# EasyEDA schematic SCH_Inky CO2 Sensor.json
TITLE: Sheet_1; REV: 1.0; Date: 2022-11-12; Sheet: 1/1; Drawn By: fmefi; Company: Your Company
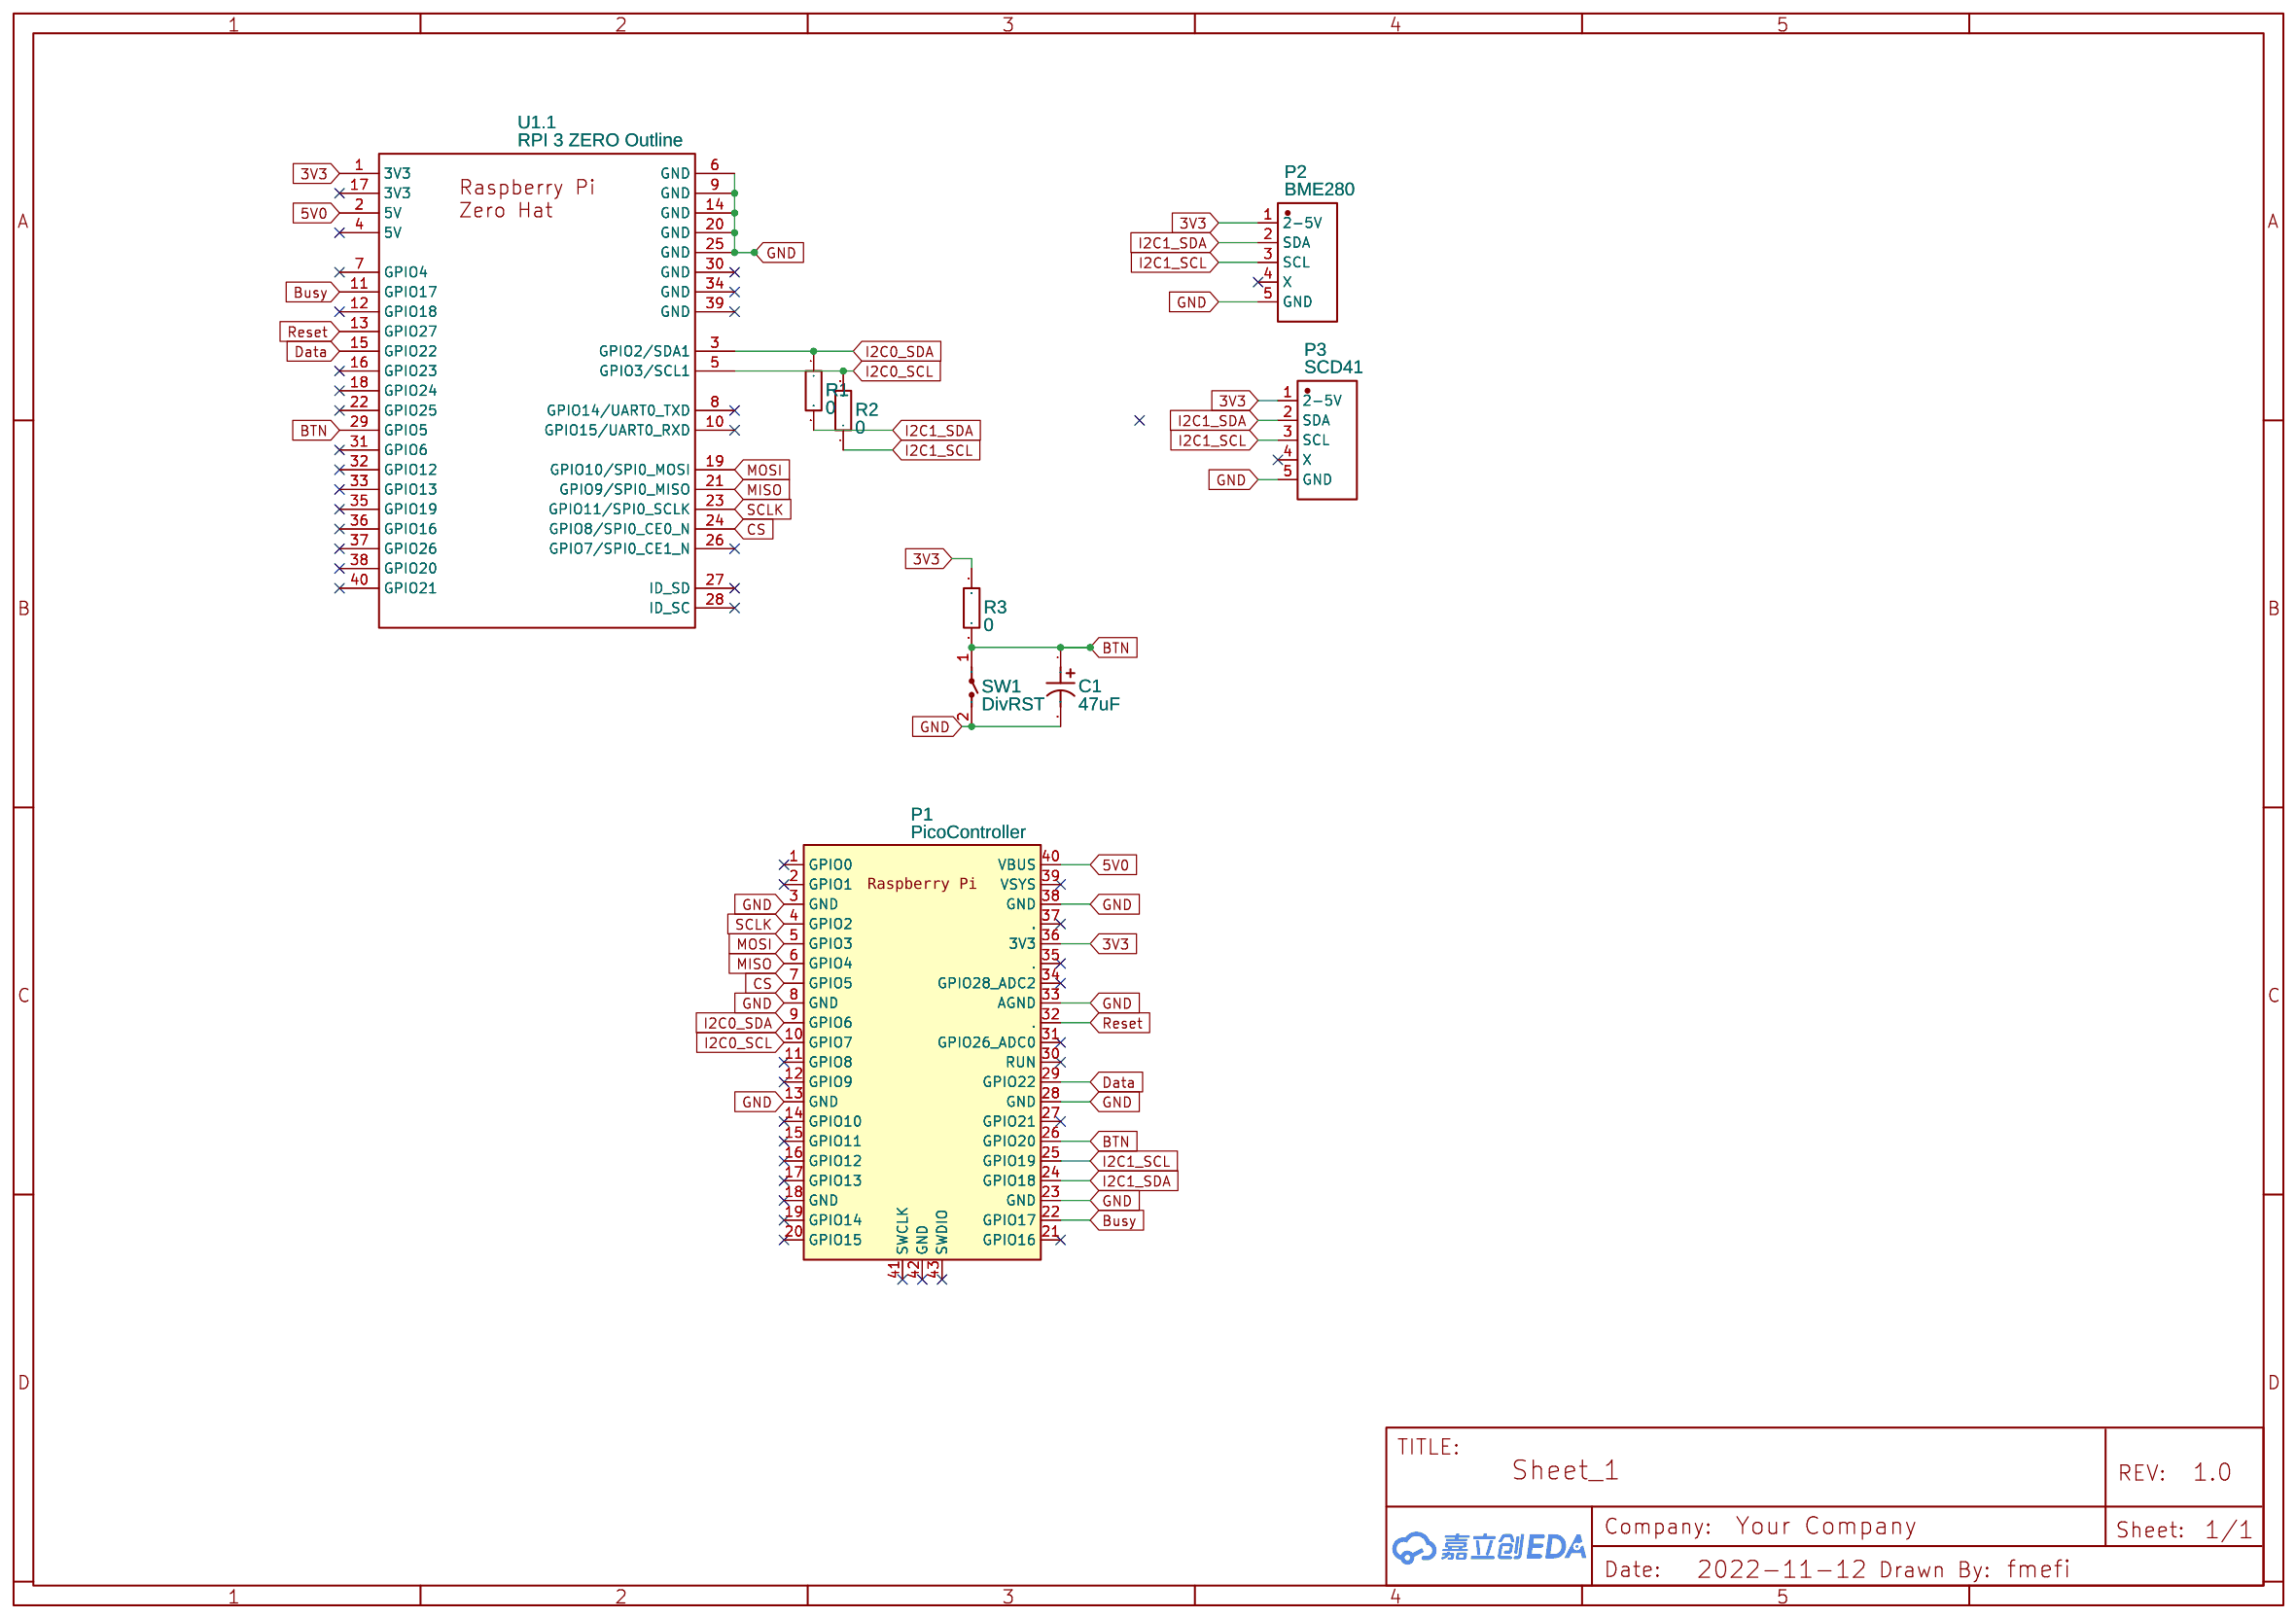
[diagram p0: schematic sheet]

## Parts
C1  47uF  [CAP-SMD_BD6.3-L6.6-W6.6-LS7.2-FD]
P1  PicoController  [RPI_PICO_SMD_TH]
P2  BME280  [BME680_PIMORONI]
P3  SCD41  [BME680_PIMORONI]
R1  0  [R0805]
R2  0  [R0805]
R3  0  [R0805]
SW1  DivRST  [SW-SMD_L6.0-W3.5-LS8.0-EH]
U1  RPI 3 ZERO Outline  [RPI3_ZERO]  (section 1)

## Library data of the parts
C1 = RVT47UF35V67RV0039: Supplier: LCSC; Supplier Part: C2836440; Manufacturer: KNSCHA(科尼盛); JLCPCB Part Class: Extended Part; Contributor: LCSC
P1 = Pico: Contributor: Alexey Gumenchuk
P2 P3 = BME680_PIMORONI: Supplier Part: C50951; Manufacturer: ReliaPro; Manufacturer Part: 2.54mm 1*5P Header; Contributor: timoschrevel
R1-R3 = 0805W8F0000T5E: Supplier: LCSC; Manufacturer: UniOhm; Supplier Part: C17477; JLCPCB Part Class: Basic Part
SW1 = TS-1001T-AC04316: Supplier: LCSC; Supplier Part: C720484; Manufacturer: XUNPU; Contributor: LCSC; JLCPCB Part Class: Extended Part
U1 = RPI 3 ZERO Outline: Manufacturer: Raspberry Pi Foundation; Supplier Part: undefined; Supplier: Adafruit; Contributor: LucAce; subpart_no: 1

## Nets
3V3: P1.36(3V3) P2.1(2-5V) P3.1(2-5V) R3.1 U1.1(3V3)
5V0: P1.40(VBUS) U1.2(5V)
GND: C1.2 P1.3(GND) P1.8(GND) P1.13(GND) P1.23(GND) P1.28(GND) P1.33(AGND) P1.38(GND) P2.5(GND) P3.5(GND) SW1.2 U1.6(GND) U1.9(GND) U1.14(GND) U1.20(GND) U1.25(GND)
BTN: C1.1 P1.26(GPIO20) R3.2 SW1.1 U1.29(GPIO5)
Busy: P1.22(GPIO17) U1.11(GPIO17)
CS: P1.7(GPIO5) U1.24(GPIO8/SPI0_CE0_N)
Data: P1.29(GPIO22) U1.15(GPIO22)
I2C0_SCL: P1.10(GPIO7) R2.2 U1.5(GPIO3/SCL1)
I2C0_SDA: P1.9(GPIO6) R1.1 U1.3(GPIO2/SDA1)
I2C1_SCL: P1.25(GPIO19) P2.3(SCL) P3.3(SCL) R2.1
I2C1_SDA: P1.24(GPIO18) P2.2(SDA) P3.2(SDA) R1.2
MISO: P1.6(GPIO4) U1.21(GPIO9/SPI0_MISO)
MOSI: P1.5(GPIO3) U1.19(GPIO10/SPI0_MOSI)
Reset: P1.32(.) U1.13(GPIO27)
SCLK: P1.4(GPIO2) U1.23(GPIO11/SPI0_SCLK)

Not connected (* = marked no-connect by the designer): P1 1(GPIO0)* 2(GPIO1)* 11(GPIO8)* 12(GPIO9)* 14(GPIO10)* 15(GPIO11)* 16(GPIO12)* 17(GPIO13)* 18(GND)* 19(GPIO14)* 20(GPIO15)* 21(GPIO16)* 27(GPIO21)* 30(RUN)* 31(GPIO26_ADC0)* 34(GPIO28_ADC2)* 35(.)* 37(.)* 39(VSYS)* 41(SWCLK)* 42(GND)* 43(SWDIO)*; P2 4(X)*; P3 4(X)*; U1 4(5V)* 7(GPIO4)* 8(GPIO14/UART0_TXD)* 10(GPIO15/UART0_RXD)* 12(GPIO18)* 16(GPIO23)* 17(3V3)* 18(GPIO24)* 22(GPIO25)* 26(GPIO7/SPI0_CE1_N)* 27(ID_SD)* 28(ID_SC)* 30(GND)* 31(GPIO6)* 32(GPIO12)* 33(GPIO13)* 34(GND)* 35(GPIO19)* 36(GPIO16)* 37(GPIO26)* 38(GPIO20)* 39(GND)* 40(GPIO21)*
